# Altium schematic sheet PI_SCH.SchDoc
size A
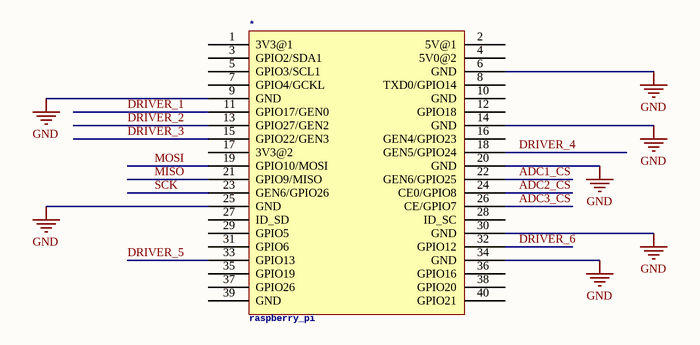
[diagram p0: PI_SCH.SchDoc]

## Parts
*  raspberry_pi

## Nets
GND: *.6(GND) *.9(GND) *.14(GND) *.20(GND) *.25(GND) *.30(GND) *.34(GND)
ADC1_CS: *.22(GEN6/GPIO25)
ADC2_CS: *.24(CE0/GPIO8)
ADC3_CS: *.26(CE/GPIO7)
DRIVER_1: *.11(GPIO17/GEN0)
DRIVER_2: *.13(GPIO27/GEN2)
DRIVER_3: *.15(GPIO22/GEN3)
DRIVER_4: *.18(GEN5/GPIO24)
DRIVER_5: *.33(GPIO13)
DRIVER_6: *.32(GPIO12)
MISO: *.21(GPIO9/MISO)
MOSI: *.19(GPIO10/MOSI)
SCK: *.23(GEN6/GPIO26)

Not connected (* = marked no-connect by the designer): * 1(3V3@1) 2(5V@1) 3(GPIO2/SDA1) 4(5V0@2) 5(GPIO3/SCL1) 7(GPIO4/GCKL) 8(TXD0/GPIO14) 10(GND) 12(GPIO18) 16(GEN4/GPIO23) 17(3V3@2) 27(ID_SD) 28(ID_SC) 29(GPIO5) 31(GPIO6) 35(GPIO19) 36(GPIO16) 37(GPIO26) 38(GPIO20) 39(GND) 40(GPIO21)